# Altium schematic sheet PowerIsolation.SchDoc
size A
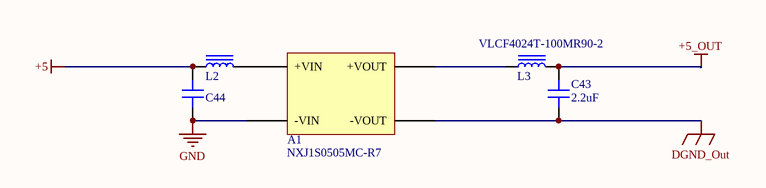
[diagram p0: PowerIsolation.SchDoc]

## Parts
A1  NXJ1S0505MC-R7  [MURATA NXJ1]
C43  2.2uF  [CAP 1206/3216]
C44  4.7uF  [CAP 1206/3216 - 1.8MM]  (value not drawn)
L2  VLCF4024T-4R7N1R4-2  [TDK VLCF4024-2]  (value not drawn)
L3  VLCF4024T-100MR90-2  [TDK VLCF4024-2]

## Nets
+5: C44.2 L2.1
+5_OUT: C43.1 L3.2
DGND_Out: A1.7(-VOUT) C43.2
GND: A1.1(-VIN) C44.1
NetA1_3: A1.3(+VIN) L2.2
NetA1_8: A1.8(+VOUT) L3.1

## Library data of the parts
A1 = NXJ1S0505MC-R7: DC/DC SM 1W 5V-5V SINGLE 4.2KV; Manufacturer: Murata Power Solutions Inc.; Number Of Outputs: 1; Voltage - Input (Min): 4.5V; Voltage - Input (Max): 5.5V; Voltage - Output 1: 5V; Current - Output (Max): 200mA; Voltage - Isolation: 4.2kV (4200V); Part Number: NXJ1S0505MC-R7; PartId: 14964; Supplier 1: Digi-Key; Supplier Part Number 1: 811-3094-1-ND; ComponentLink1Description: Datasheet; ComponentLink1URL: http://power.murata.com/data/power/ncl/kdc_nxj1.pdf; ComponentLink2Description: Digi-Key Listing; ComponentLink2URL: https://www.digikey.com/product-detail/en/murata-power-solutions-inc/NXJ1S0505MC-R7/811-3094-1-ND/5697921; Price: 3.55; Type: Isolated Module; Device Package: 14-SMD Module (5 Leads); Operating Temperature: -40C ~ 85C; Power (Watts): 1W
C43 = CL31B225KCHSNNE: CAP CER 2.2UF 100V X7R 1206; Manufacturer: Samsung Electro-Mechanics America, Inc.; TemperatureRange: -55C ~ 125C; Tolerance: 10%; Value: 2.2uF; Part Number: CL31B225KCHSNNE; PartId: 6260; Supplier 1: Digi-Key; Supplier Part Number 1: 1276-3138-2-ND; ComponentLink1Description: Datasheet; ComponentLink1URL: http://media.digikey.com/pdf/Data%20Sheets/Samsung%20PDFs/CL31B225KCHSNNE_Spec.pdf; ComponentLink2Description: Digi-Key listing; ComponentLink2URL: http://digikey.com/product-detail/en/CL31B225KCHSNNE/1276-3138-2-ND/3888796; TemperatureCoefficient: X7R; Voltage: 100V; Price: 0.3227; Type: -; Device Package: 1206 (3216 Metric)
C44 = CL31B475KPHNNNE: CAP CER 4.7UF 10V X7R 1206; Manufacturer: Samsung Electro-Mechanics America, Inc.; TemperatureRange: -55C ~ 125C; Tolerance: 10%; Value: 4.7uF; Part Number: CL31B475KPHNNNE; PartId: 17410; Supplier 1: Digi-Key; Supplier Part Number 1: 1276-1133-2-ND; ComponentLink1Description: Datasheet; ComponentLink1URL: http://www.samsungsem.com/kr/front/downloadcms.do?path=/kr/support/product-search/mlcc/__icsFiles/afieldfile/2014/11/05&fileName=C_CL31B475KPHNNNE.pdf; ComponentLink2Description: Digi-Key Listing; ComponentLink2URL: https://www.digikey.com/product-detail/en/samsung-electro-mechanics-america-inc/CL31B475KPHNNNE/1276-1133-2-ND/3886791; TemperatureCoefficient: X7R; Voltage: 10V; Price: 0.0761; Device Package: 1206 (3216 Metric)
L2 = VLCF4024T-4R7N1R4-2: FIXED IND 4.7UH 1.43A 87 MOHM; Manufacturer: TDK Corporation; Type: Wirewound; Material - Core: Ferrite; Tolerance: 30%; Shielding: Shielded; DC Resistance (DCR): 87 mOhm Max; Value: 4.7uH; Part Number: VLCF4024T-4R7N1R4-2; PartId: 16432; Supplier 1: Digi-Key; Supplier Part Number 1: 445-8737-2-ND; ComponentLink1Description: Datasheet; ComponentLink1URL: https://product.tdk.com/info/en/catalog/datasheets/inductor_commercial_power_vlcf4024-2_en.pdf; ComponentLink2Description: Digi-Key Listing; ComponentLink2URL: https://www.digikey.com/product-detail/en/tdk-corporation/VLCF4024T-4R7N1R4-2/445-8737-2-ND/3083279; Price: 0.441; Device Package: Nonstandard; Series: VLCF; Inductance: 4.7uH; Current Rating: 1.43A; Current - Saturation: 1.43A; Operating Temperature: -40C ~ 105C
L3 = VLCF4024T-100MR90-2: FIXED IND 10UH 900MA 136 MOHM; Manufacturer: TDK Corporation; Type: Wirewound; Material - Core: Ferrite; Tolerance: 20%; Shielding: Shielded; DC Resistance (DCR): 136 mOhm Max; Value: 10uH; Part Number: VLCF4024T-100MR90-2; PartId: 16429; Supplier 1: Digi-Key; Supplier Part Number 1: 445-8727-2-ND; ComponentLink1Description: Datasheet; ComponentLink1URL: https://product.tdk.com/info/en/catalog/datasheets/inductor_commercial_power_vlcf4024-2_en.pdf; ComponentLink2Description: Digi-Key Listing; ComponentLink2URL: https://www.digikey.com/product-detail/en/tdk-corporation/VLCF4024T-100MR90-2/445-8727-2-ND/3083281; Price: 0.441; Device Package: Nonstandard; Series: VLCF; Inductance: 10uH; Current Rating: 900mA; Current - Saturation: 900mA; Operating Temperature: -40C ~ 105C